# EasyEDA schematic 各种验证板.json
TITLE: Sheet_1; REV: 1.0; Date: 2022-09-18; Sheet: 1/1; Company: Your Company
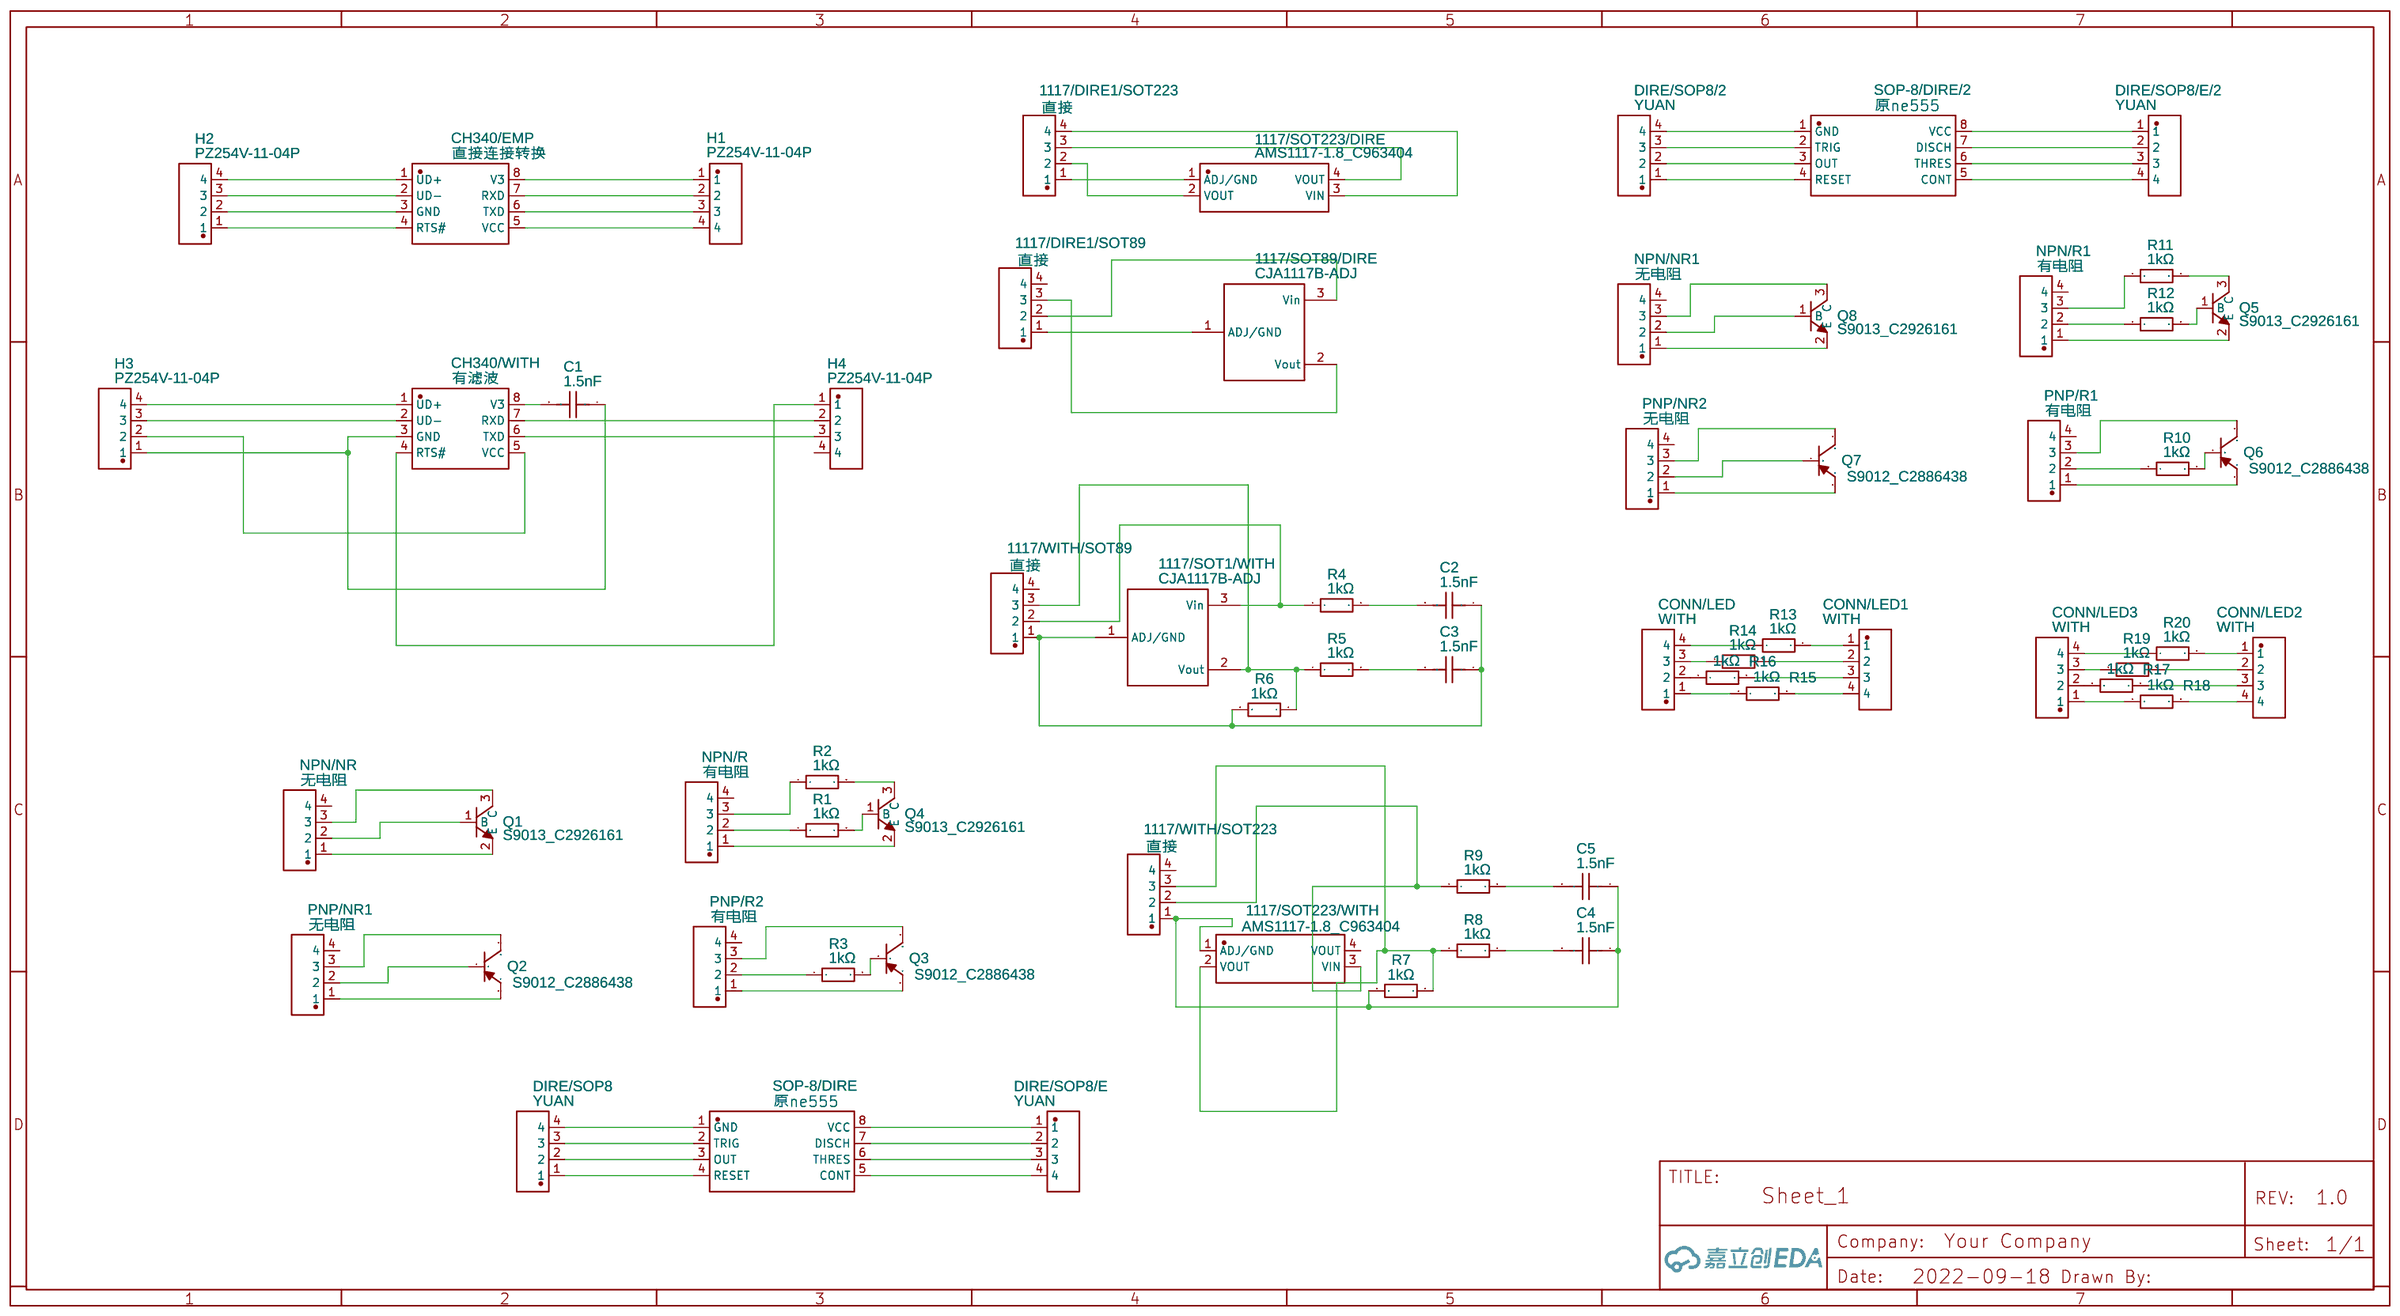
[diagram p0: schematic sheet]

## Parts
1117/DIRE1/SOT89  直接  [HDR-TH_4P-P2.54-V-M]
1117/DIRE1/SOT223  直接  [HDR-TH_4P-P2.54-V-M]
1117/SOT1/WITH  CJA1117B-ADJ  [SOT-89_L4.5-W2.5-P1.50-LS4.2-BR]
1117/SOT89/DIRE  CJA1117B-ADJ  [SOT-89_L4.5-W2.5-P1.50-LS4.2-BR]
1117/SOT223/DIRE  AMS1117-1.8_C963404  [SOT-223-3_L6.7-W3.7-P2.30-LS7.0-BR]
1117/SOT223/WITH  AMS1117-1.8_C963404  [SOT-223-3_L6.7-W3.7-P2.30-LS7.0-BR]
1117/WITH/SOT89  直接  [HDR-TH_4P-P2.54-V-M]
1117/WITH/SOT223  直接  [HDR-TH_4P-P2.54-V-M]
C1  1.5nF  [C0603]
C2  1.5nF  [C0603]
C3  1.5nF  [C0603]
C4  1.5nF  [C0603]
C5  1.5nF  [C0603]
CH340/EMP  直接连接转换  [SOP-8_L4.9-W3.9-P1.27-LS6.0-BL]
CH340/WITH  有滤波  [SOP-8_L4.9-W3.9-P1.27-LS6.0-BL]
CONN/LED  WITH  [HDR-TH_4P-P2.54-V-M]
CONN/LED1  WITH  [HDR-TH_4P-P2.54-V-M]
CONN/LED2  WITH  [HDR-TH_4P-P2.54-V-M]
CONN/LED3  WITH  [HDR-TH_4P-P2.54-V-M]
DIRE/SOP8  YUAN  [HDR-TH_4P-P2.54-V-M]
DIRE/SOP8/2  YUAN  [HDR-TH_4P-P2.54-V-M]
DIRE/SOP8/E  YUAN  [HDR-TH_4P-P2.54-V-M]
DIRE/SOP8/E/2  YUAN  [HDR-TH_4P-P2.54-V-M]
H1  PZ254V-11-04P  [HDR-TH_4P-P2.54-V-M]
H2  PZ254V-11-04P  [HDR-TH_4P-P2.54-V-M]
H3  PZ254V-11-04P  [HDR-TH_4P-P2.54-V-M]
H4  PZ254V-11-04P  [HDR-TH_4P-P2.54-V-M]
NPN/NR  无电阻  [HDR-TH_4P-P2.54-V-M]
NPN/NR1  无电阻  [HDR-TH_4P-P2.54-V-M]
NPN/R  有电阻  [HDR-TH_4P-P2.54-V-M]
NPN/R1  有电阻  [HDR-TH_4P-P2.54-V-M]
PNP/NR1  无电阻  [HDR-TH_4P-P2.54-V-M]
PNP/NR2  无电阻  [HDR-TH_4P-P2.54-V-M]
PNP/R1  有电阻  [HDR-TH_4P-P2.54-V-M]
PNP/R2  有电阻  [HDR-TH_4P-P2.54-V-M]
Q1  S9013_C2926161  [SOT-23-3_L2.9-W1.3-P1.90-LS2.4-BR]
Q2  S9012_C2886438  [SOT-23-3_L2.9-W1.4-P1.91-LS2.6-BR]
Q3  S9012_C2886438  [SOT-23-3_L2.9-W1.4-P1.91-LS2.6-BR]
Q4  S9013_C2926161  [SOT-23-3_L2.9-W1.3-P1.90-LS2.4-BR]
Q5  S9013_C2926161  [SOT-23-3_L2.9-W1.3-P1.90-LS2.4-BR]
Q6  S9012_C2886438  [SOT-23-3_L2.9-W1.4-P1.91-LS2.6-BR]
Q7  S9012_C2886438  [SOT-23-3_L2.9-W1.4-P1.91-LS2.6-BR]
Q8  S9013_C2926161  [SOT-23-3_L2.9-W1.3-P1.90-LS2.4-BR]
R1  1kΩ  [R0603]
R2  1kΩ  [R0603]
R3  1kΩ  [R0603]
R4  1kΩ  [R0603]
R5  1kΩ  [R0603]
R6  1kΩ  [R0603]
R7  1kΩ  [R0603]
R8  1kΩ  [R0603]
R9  1kΩ  [R0603]
R10  1kΩ  [R0603]
R11  1kΩ  [R0603]
R12  1kΩ  [R0603]
R13  1kΩ  [R0603]
R14  1kΩ  [R0603]
R15  1kΩ  [R0603]
R16  1kΩ  [R0603]
R17  1kΩ  [R0603]
R18  1kΩ  [R0603]
R19  1kΩ  [R0603]
R20  1kΩ  [R0603]
SOP-8/DIRE  原ne555  [SOIC-8_L4.9-W3.9-P1.27-LS6.0-BL]
SOP-8/DIRE/2  原ne555  [SOIC-8_L4.9-W3.9-P1.27-LS6.0-BL]

## Library data of the parts
1117/DIRE1/SOT89 1117/DIRE1/SOT223 1117/WITH/SOT89 1117/WITH/SOT223 CONN/LED CONN/LED1-CONN/LED3 DIRE/SOP8 DIRE/SOP8/2 DIRE/SOP8/E DIRE/SOP8/E/2 H1-H4 NPN/NR NPN/NR1 NPN/R NPN/R1 PNP/NR1 PNP/NR2 PNP/R1 PNP/R2 = PZ254V-11-04P: Supplier: LCSC; Supplier Part: C492403; Manufacturer: XFCN; Contributor: LCSC; JLCPCB Part Class: Extended Part
1117/SOT1/WITH 1117/SOT89/DIRE = CJA1117B-ADJ: Supplier: LCSC; Manufacturer: CJ; Supplier Part: C107222; JLCPCB Part Class: Extended Part
1117/SOT223/DIRE 1117/SOT223/WITH = AMS1117-1.8_C963404: Supplier: LCSC; Supplier Part: C963404; Manufacturer: JSMSEMI(杰盛微); Manufacturer Part: AMS1117-1.8; JLCPCB Part Class: Extended Part; Contributor: LCSC
C1-C5 = CL10B152KB8NNNC: Supplier: LCSC; Manufacturer: SAMSUNG; Contributor: LCSC; Supplier Part: C37788; JLCPCB Part Class: Extended Part
CH340/EMP CH340/WITH = CH340N_C2977777: Supplier: LCSC; Supplier Part: C2977777; Manufacturer: WCH(南京沁恒); Manufacturer Part: CH340N; Contributor: LCSC; JLCPCB Part Class: Extended Part
Q1 Q4 Q5 Q8 = S9013_C2926161: Supplier: LCSC; Supplier Part: C2926161; Manufacturer: FOSAN(富信); Manufacturer Part: S9013; Contributor: LCSC; JLCPCB Part Class: Extended Part
Q2 Q3 Q6 Q7 = S9012_C2886438: Supplier: LCSC; Supplier Part: C2886438; Manufacturer: Hottech(合科泰); Manufacturer Part: S9012; Contributor: LCSC; JLCPCB Part Class: Extended Part
R1-R20 = 0603WAF1001T5E: Supplier: LCSC; Manufacturer: UniOhm; Supplier Part: C21190; Resistance (Ohms): 1K; JLCPCB Part Class: Basic Part
SOP-8/DIRE SOP-8/DIRE/2 = NE555_C5125085: Supplier: LCSC; Supplier Part: C5125085; Manufacturer: IDCHIP(英锐芯); Manufacturer Part: NE555; Contributor: lcsc

## Nets
Net-(1117/DIRE1/SOT89-1): 1117/DIRE1/SOT89.1 1117/SOT89/DIRE.1(ADJ/GND)
Net-(1117/DIRE1/SOT89-2): 1117/DIRE1/SOT89.2 1117/SOT89/DIRE.3(Vin)
Net-(1117/DIRE1/SOT89-3): 1117/DIRE1/SOT89.3 1117/SOT89/DIRE.2(Vout)
Net-(1117/DIRE1/SOT223-1): 1117/DIRE1/SOT223.1 1117/SOT223/DIRE.1(ADJ/GND)
Net-(1117/DIRE1/SOT223-2): 1117/DIRE1/SOT223.2 1117/SOT223/DIRE.2(VOUT)
Net-(1117/DIRE1/SOT223-3): 1117/DIRE1/SOT223.3 1117/SOT223/DIRE.4(VOUT)
Net-(1117/DIRE1/SOT223-4): 1117/DIRE1/SOT223.4 1117/SOT223/DIRE.3(VIN)
Net-(1117/SOT1/WITH-1): 1117/SOT1/WITH.1(ADJ/GND) 1117/WITH/SOT89.1 C2.1 C3.1 R6.2
Net-(1117/SOT1/WITH-2): 1117/SOT1/WITH.2(Vout) 1117/WITH/SOT89.3 R5.1 R6.1
Net-(1117/SOT1/WITH-3): 1117/SOT1/WITH.3(Vin) 1117/WITH/SOT89.2 R4.1
Net-(1117/SOT223/WITH-1): 1117/SOT223/WITH.1(ADJ/GND) 1117/WITH/SOT223.1 C4.1 C5.1 R7.2
Net-(1117/SOT223/WITH-2): 1117/SOT223/WITH.2(VOUT) 1117/WITH/SOT223.3 R7.1 R8.1
Net-(1117/SOT223/WITH-3): 1117/SOT223/WITH.3(VIN) 1117/WITH/SOT223.2 R9.1
Net-(C1-1): C1.1 CH340/WITH.3(GND) H3.1
Net-(C1-2): C1.2 CH340/WITH.8(V3)
Net-(C2-2): C2.2 R4.2
Net-(C3-2): C3.2 R5.2
Net-(C4-2): C4.2 R8.2
Net-(C5-2): C5.2 R9.2
Net-(CH340/EMP-1): CH340/EMP.1(UD+) H2.4
Net-(CH340/EMP-2): CH340/EMP.2(UD-) H2.3
Net-(CH340/EMP-3): CH340/EMP.3(GND) H2.2
Net-(CH340/EMP-4): CH340/EMP.4(RTS#) H2.1
Net-(CH340/EMP-5): CH340/EMP.5(VCC) H1.4
Net-(CH340/EMP-6): CH340/EMP.6(TXD) H1.3
Net-(CH340/EMP-7): CH340/EMP.7(RXD) H1.2
Net-(CH340/EMP-8): CH340/EMP.8(V3) H1.1
Net-(CH340/WITH-1): CH340/WITH.1(UD+) H3.4
Net-(CH340/WITH-2): CH340/WITH.2(UD-) H3.3
Net-(CH340/WITH-4): CH340/WITH.4(RTS#) H4.1
Net-(CH340/WITH-5): CH340/WITH.5(VCC) H3.2
Net-(CH340/WITH-6): CH340/WITH.6(TXD) H4.3
Net-(CH340/WITH-7): CH340/WITH.7(RXD) H4.2
Net-(CONN/LED1-1): CONN/LED1.1 R13.2
Net-(CONN/LED1-2): CONN/LED1.2 R14.2
Net-(CONN/LED1-3): CONN/LED1.3 R16.2
Net-(CONN/LED1-4): CONN/LED1.4 R15.2
Net-(CONN/LED2-1): CONN/LED2.1 R20.2
Net-(CONN/LED2-2): CONN/LED2.2 R19.2
Net-(CONN/LED2-3): CONN/LED2.3 R17.2
Net-(CONN/LED2-4): CONN/LED2.4 R18.2
Net-(CONN/LED3-1): CONN/LED3.1 R18.1
Net-(CONN/LED3-2): CONN/LED3.2 R17.1
Net-(CONN/LED3-3): CONN/LED3.3 R19.1
Net-(CONN/LED3-4): CONN/LED3.4 R20.1
Net-(CONN/LED-1): CONN/LED.1 R15.1
Net-(CONN/LED-2): CONN/LED.2 R16.1
Net-(CONN/LED-3): CONN/LED.3 R14.1
Net-(CONN/LED-4): CONN/LED.4 R13.1
Net-(DIRE/SOP8-1): DIRE/SOP8.1 SOP-8/DIRE.4(RESET)
Net-(DIRE/SOP8-2): DIRE/SOP8.2 SOP-8/DIRE.3(OUT)
Net-(DIRE/SOP8-3): DIRE/SOP8.3 SOP-8/DIRE.2(TRIG)
Net-(DIRE/SOP8-4): DIRE/SOP8.4 SOP-8/DIRE.1(GND)
Net-(DIRE/SOP8/2-1): DIRE/SOP8/2.1 SOP-8/DIRE/2.4(RESET)
Net-(DIRE/SOP8/2-2): DIRE/SOP8/2.2 SOP-8/DIRE/2.3(OUT)
Net-(DIRE/SOP8/2-3): DIRE/SOP8/2.3 SOP-8/DIRE/2.2(TRIG)
Net-(DIRE/SOP8/2-4): DIRE/SOP8/2.4 SOP-8/DIRE/2.1(GND)
Net-(DIRE/SOP8/E-1): DIRE/SOP8/E.1 SOP-8/DIRE.8(VCC)
Net-(DIRE/SOP8/E-2): DIRE/SOP8/E.2 SOP-8/DIRE.7(DISCH)
Net-(DIRE/SOP8/E-3): DIRE/SOP8/E.3 SOP-8/DIRE.6(THRES)
Net-(DIRE/SOP8/E-4): DIRE/SOP8/E.4 SOP-8/DIRE.5(CONT)
Net-(DIRE/SOP8/E/2-1): DIRE/SOP8/E/2.1 SOP-8/DIRE/2.8(VCC)
Net-(DIRE/SOP8/E/2-2): DIRE/SOP8/E/2.2 SOP-8/DIRE/2.7(DISCH)
Net-(DIRE/SOP8/E/2-3): DIRE/SOP8/E/2.3 SOP-8/DIRE/2.6(THRES)
Net-(DIRE/SOP8/E/2-4): DIRE/SOP8/E/2.4 SOP-8/DIRE/2.5(CONT)
Net-(NPN/NR1-1): NPN/NR1.1 Q8.2(E)
Net-(NPN/NR1-2): NPN/NR1.2 Q8.1(B)
Net-(NPN/NR1-3): NPN/NR1.3 Q8.3(C)
Net-(NPN/NR-1): NPN/NR.1 Q1.2(E)
Net-(NPN/NR-2): NPN/NR.2 Q1.1(B)
Net-(NPN/NR-3): NPN/NR.3 Q1.3(C)
Net-(NPN/R1-1): NPN/R1.1 Q5.2(E)
Net-(NPN/R1-2): NPN/R1.2 R12.1
Net-(NPN/R1-3): NPN/R1.3 R11.1
Net-(NPN/R-1): NPN/R.1 Q4.2(E)
Net-(NPN/R-2): NPN/R.2 R1.1
Net-(NPN/R-3): NPN/R.3 R2.1
Net-(PNP/NR1-1): PNP/NR1.1 Q2.2(E)
Net-(PNP/NR1-2): PNP/NR1.2 Q2.1(B)
Net-(PNP/NR1-3): PNP/NR1.3 Q2.3(C)
Net-(PNP/NR2-1): PNP/NR2.1 Q7.2(E)
Net-(PNP/NR2-2): PNP/NR2.2 Q7.1(B)
Net-(PNP/NR2-3): PNP/NR2.3 Q7.3(C)
Net-(PNP/R1-1): PNP/R1.1 Q6.2(E)
Net-(PNP/R1-2): PNP/R1.2 R10.1
Net-(PNP/R1-3): PNP/R1.3 Q6.3(C)
Net-(PNP/R2-1): PNP/R2.1 Q3.2(E)
Net-(PNP/R2-2): PNP/R2.2 R3.1
Net-(PNP/R2-3): PNP/R2.3 Q3.3(C)
Net-(Q3-1): Q3.1(B) R3.2
Net-(Q4-1): Q4.1(B) R1.2
Net-(Q4-3): Q4.3(C) R2.2
Net-(Q5-1): Q5.1(B) R12.2
Net-(Q5-3): Q5.3(C) R11.2
Net-(Q6-1): Q6.1(B) R10.2

Not connected (* = marked no-connect by the designer): 1117/DIRE1/SOT89 4; 1117/SOT223/WITH 4(VOUT); 1117/WITH/SOT89 4; 1117/WITH/SOT223 4; H4 4; NPN/NR 4; NPN/NR1 4; NPN/R 4; NPN/R1 4; PNP/NR1 4; PNP/NR2 4; PNP/R1 4; PNP/R2 4
